# EAGLE board rx08-vrs (EAGLE 6.6.0)
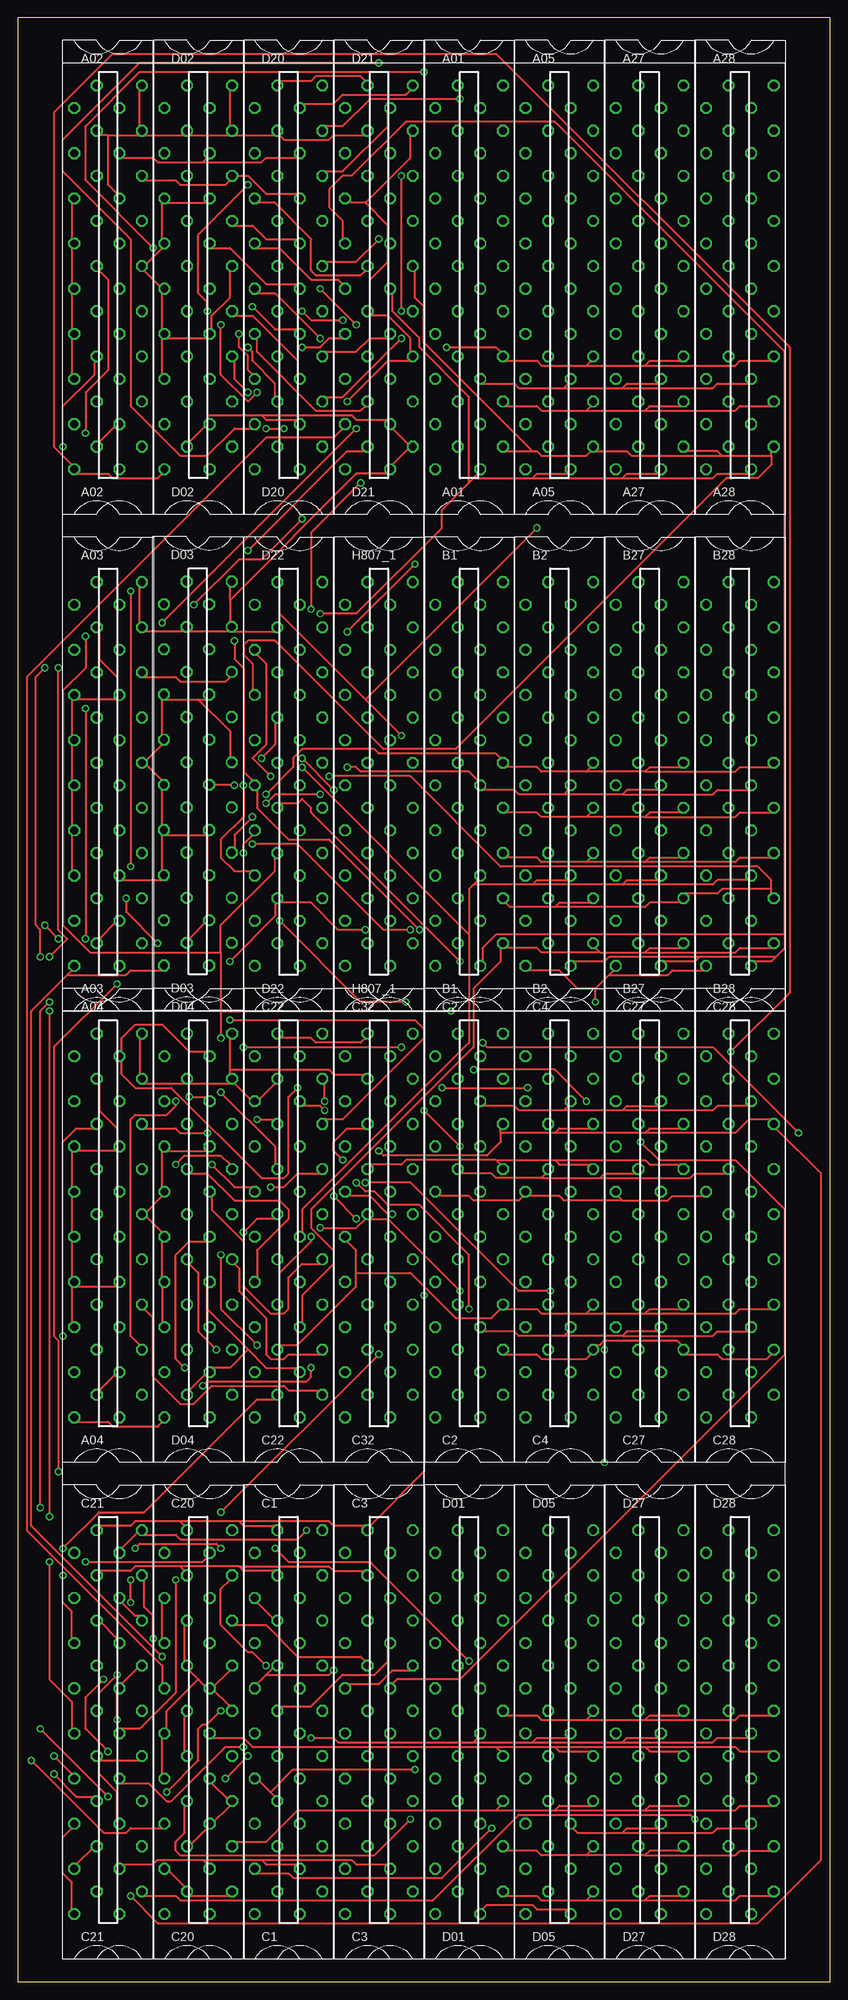
[diagram p1: board, top side]
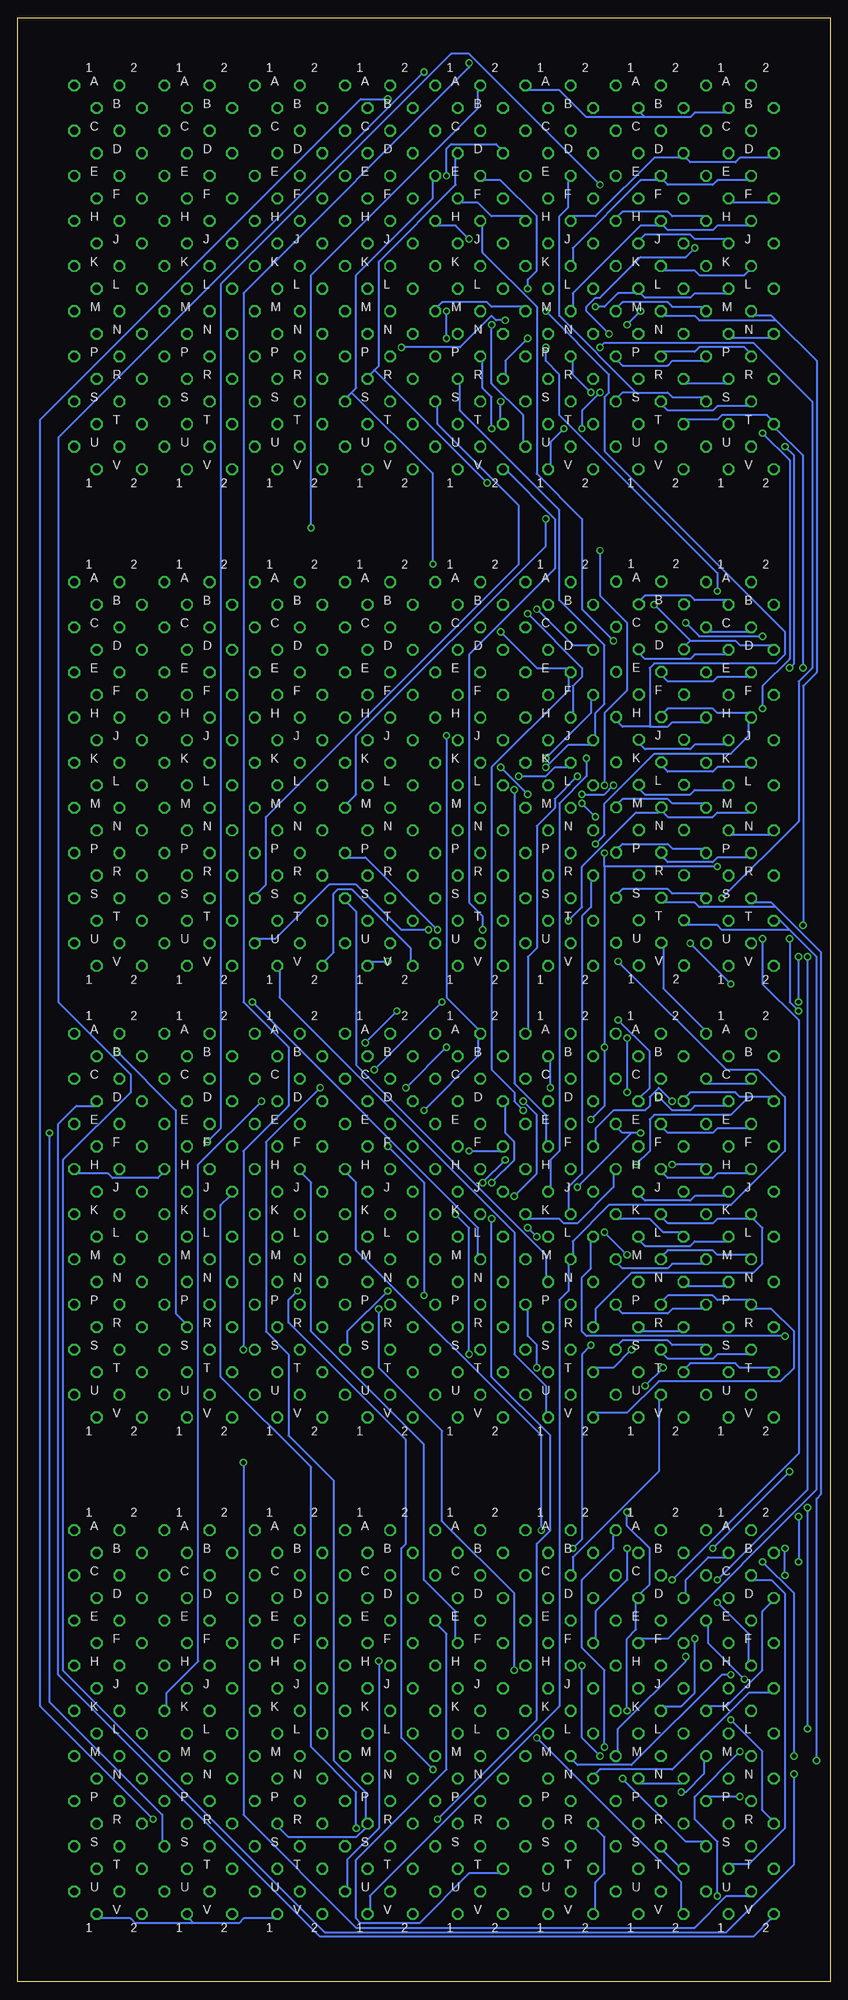
[diagram p2: board, bottom side, seen from below]

Size 114.3 x 276.23 mm. Coordinates in mm from the lower left corner, seen from the top.
Outline: 0,0 114.3,0 114.3,276.23 0,276.23 0,0
Copper layers (1*16): Top 0.035mm / dielectric 1.5mm / Bottom 0.035mm
Design rules "olimex10mil": minimum track width 10mil, minimum drill 24mil, track to track 10mil, track to pad 10mil, pad to pad 10mil, via to via 10mil, smd to smd 10mil, copper to edge 40mil, drill to drill 10mil, minimum pad ring 10mil, minimum via ring 8mil, stop-mask expansion 0mil, vias tented up to drill 0mil, thermal gap 10mil
Net classes: 1 Supply: width 1.905 mm, clearance 0.508 mm

## Footprints (pad centres in the part's own frame; a part is rotated, then mirrored left to right if it is on the bottom)
H807 = drill 1.092 octagon: A1 4.763,28.575; A2 -1.587,28.575; B1 1.587,25.4; B2 -4.763,25.4; C1 4.763,22.225; C2 -1.587,22.225; D1 1.587,19.05; D2 -4.763,19.05; E1 4.763,15.875; E2 -1.587,15.875; F1 1.587,12.7; F2 -4.763,12.7; H1 4.763,9.525; H2 -1.587,9.525; J1 1.587,6.35; J2 -4.763,6.35; K1 4.763,3.175; K2 -1.587,3.175; L1 1.587,0; L2 -4.763,0; M1 4.763,-3.175; M2 -1.587,-3.175; N1 1.587,-6.35; N2 -4.763,-6.35; P1 4.763,-9.525; P2 -1.587,-9.525; R1 1.587,-12.7; R2 -4.763,-12.7; S1 4.763,-15.875; S2 -1.587,-15.875; T1 1.587,-19.05; T2 -4.763,-19.05; U1 4.763,-22.225; U2 -1.587,-22.225; V1 1.587,-25.4; V2 -4.763,-25.4

## Placement (x,y rotation side)
A01  [H807]  63.5,238.12 0 top
A02  M903  [H807]  12.7,238.12 0 top
A03  M903  [H807]  12.7,168.28 0 top
A04  M903  [H807]  12.7,104.78 0 top
A05  [H807]  76.2,238.12 0 top
A27  [H807]  88.9,238.12 0 top
A28  [H807]  101.6,238.12 0 top
B1  [H807]  63.5,168.28 0 top
B2  [H807]  76.2,168.28 0 top
B27  [H807]  88.9,168.28 0 top
B28  [H807]  101.6,168.28 0 top
C1  [H807]  38.1,34.92 0 top
C2  [H807]  63.5,104.78 0 top
C3  M310  [H807]  50.8,34.92 0 top
C4  [H807]  76.2,104.78 0 top
C20  [H807]  25.4,34.92 0 top
C21  [H807]  12.7,34.92 0 top
C22  M624  [H807]  38.1,104.78 0 top
C27  [H807]  88.9,104.78 0 top
C28  [H807]  101.6,104.78 0 top
C32  M002  [H807]  50.8,104.78 0 top
D01  [H807]  63.5,34.92 0 top
D02  M903  [H807]  25.4,238.12 0 top
D03  M903  [H807]  25.34,168.34 0 top
D04  M903  [H807]  25.4,104.78 0 top
D05  [H807]  76.2,34.92 0 top
D20  [H807]  38.1,238.12 0 top
D21  [H807]  50.8,238.12 0 top
D22  M002  [H807]  38.1,168.28 0 top
D27  [H807]  88.9,34.92 0 top
D28  [H807]  101.6,34.92 0 top
H807_1  H807  [H807]  50.8,168.28 0 top
U$1  [CBLOCK]  6.35,136.53 0 top
U$2  [CBLOCK]  57.15,136.53 0 top
U$3  [CBLOCK]  6.35,3.17 0 top
U$4  [CBLOCK]  57.15,3.17 0 top

## Tracks (layer width: path | path; a pad name or v marks a point on that pad's centre or on a via)
AC00L  (via drill 0.61)
  Top 0.254: D04.B1 26.67,130.81 24.13,130.81 20.32,134.62 16.51,134.62 14.61,132.72 14.61,130.81 A04.B1 14.61,129.54 14.61,127.64 16.51,125.73 21.59,125.73 34.29,113.03 37.47,113.03 38.1,113.67 38.1,124.46 v39.37,125.73
  Bottom 0.254: v39.37,125.73 39.37,129.54 C22.B1
AC01L  (via drill 0.61)
  Top 0.254: v24.13,124.46 26.67,124.46 D04.D1 | v29.84,135.25 55.88,135.25 57.15,133.99 57.15,132.72 45.72,121.28 43.18,121.28 C22.E1
  Bottom 0.254: v24.13,124.46 22.23,122.56 19.68,122.56 19.05,123.19 14.61,123.19 A04.D1 | v29.84,135.25 25.4,130.81 25.4,125.73 26.67,124.46 D04.D1
AC02L  (via drill 0.61)
  Top 0.254: v26.67,119.38 22.86,119.38 22.23,120.02 17.78,120.02 A04.E1 | v35.56,111.76 37.47,111.76 39.37,113.67 42.55,113.67 C22.H1
  Bottom 0.254: 27.94,119.38 29.21,119.38 29.84,120.02 D04.E1 | v26.67,119.38 27.94,119.38 | 27.94,119.38 v35.56,111.76
AC03L  (via drill 0.61)
  Top 0.254: v22.23,114.94 23.5,116.2 28.57,116.2 29.84,114.94 D04.H1
  Bottom 0.254: v22.23,114.94 17.78,114.94 A04.H1 | C22.K1 42.55,107.31 38.1,107.31 37.47,106.68 35.56,106.68 30.48,111.76 30.48,113.67 D04.H1
AC04L
  Top 0.254: C22.M1 42.55,100.97 40.01,100.97 38.1,99.06 38.1,94.61 37.47,93.98 35.56,93.98 31.75,97.79 31.75,104.14 27.3,108.58 27.3,110.49 D04.J1
  Bottom 0.254: A04.J1 14.61,110.49 19.05,110.49 19.68,109.86 26.04,109.86 26.67,110.49 D04.J1
AC05L  (via drill 0.61)
  Top 0.254: v41.27,86.36 41.27,85.09 40.64,84.45 26.67,84.45 v26.04,83.82 | v23.5,86.36 22.23,87.63 22.23,102.23 24.13,104.14 26.67,104.14 D04.L1
  Bottom 0.254: A04.L1 14.61,104.14 19.05,104.14 19.68,103.5 26.04,103.5 26.67,104.14 D04.L1 | v41.27,86.36 41.27,89.53 42.55,90.81 42.55,94.61 C22.P1 | v23.5,86.36 v26.04,83.82
AC06L
  Top 0.254: C22.S1 42.55,88.27 38.1,88.27 37.47,87.63 35.56,87.63 34.92,88.27 34.92,93.34 31.11,97.16 31.11,100.33 30.48,100.97 D04.M1
  Bottom 0.254: A04.M1 17.78,100.97 22.23,100.97 22.86,100.33 29.21,100.33 29.84,100.97 D04.M1
AC07L
  Top 0.254: C22.U1 42.55,83.19 38.1,83.19 37.47,83.82 27.3,83.82 24.77,81.28 22.86,81.28 19.05,85.09 19.05,93.34 17.78,94.61 A04.P1
  Bottom 0.254: A04.P1 17.78,94.61 22.23,94.61 22.86,93.98 29.21,93.98 29.84,94.61 D04.P1
AC08L  (via drill 0.61)
  Top 0.254: v22.23,123.83 22.23,123.19 20.95,121.92 16.51,121.92 15.88,121.28 15.88,90.81 17.14,89.53 A04.S1
  Bottom 0.254: A04.S1 17.78,89.53 22.23,89.53 22.86,90.17 29.21,90.17 29.84,89.53 D04.S1 | v22.23,123.83 24.13,125.73 25.4,124.46 25.4,123.19 26.04,122.56 30.48,122.56 33.02,120.02 33.02,118.11 C22.F2
AC09L  (via drill 0.61)
  Top 0.254: v27.3,114.94 30.48,111.76 33.02,111.76 C22.J2
  Bottom 0.254: 11.43,124.46 12.7,124.46 13.34,125.09 19.68,125.09 20.32,124.46 D04.D2 | 11.43,124.46 8.26,124.46 A04.D2 | v27.3,114.94 25.4,116.84 25.4,121.28 24.77,121.92 13.97,121.92 11.43,124.46
AC10L  (via drill 0.61)
  Top 0.254: v6.35,90.81 6.35,118.11 8.26,120.02 10.79,120.02 A04.E2
  Bottom 0.254: A04.E2 11.43,120.02 15.88,120.02 16.51,119.38 22.86,119.38 23.5,120.02 D04.E2 | v6.35,90.81 34.29,90.81 34.92,91.44 34.92,99.06 33.66,100.33 33.66,104.14 C22.L2
AC11L
  Top 0.254: C22.N2 33.66,99.06 33.66,102.87 38.1,107.31 38.1,108.58 36.83,109.86 30.48,109.86 26.67,113.67 24.13,113.67 D04.H2
  Bottom 0.254: A04.H2 11.43,113.67 15.88,113.67 16.51,113.03 22.86,113.03 23.5,113.67 D04.H2
BAC00
  Bottom 0.254: 26.04,262.25 19.68,262.25 19.05,262.89 14.61,262.89 A02.B1 | 26.04,262.25 26.67,262.89 D02.B1 | 26.04,262.25 34.29,262.25 38.1,266.06 42.55,266.06 D20.A1
BAC01
  Top 0.254: 26.04,255.91 19.68,255.91 19.05,256.54 14.61,256.54 A02.D1 | 26.04,255.91 26.67,256.54 D02.D1 | 26.04,255.91 34.29,255.91 34.92,256.54 39.37,256.54 D20.D1
BAC02
  Top 0.254: A02.E1 17.78,253.37 22.23,253.37 22.86,252.73 29.21,252.73 29.84,253.37 D02.E1 32.38,254 34.92,251.46 39.37,251.46 D20.F1
BAC03
  Top 0.254: D20.J1 39.37,245.11 34.92,245.11 33.02,247.01 30.48,247.01 D02.H1
  Bottom 0.254: A02.H1 17.78,248.28 22.23,248.28 22.86,248.92 29.21,248.92 29.84,248.28 D02.H1
BAC04
  Top 0.254: D20.L1 39.37,238.76 34.92,238.76 29.84,243.84 27.3,243.84 D02.J1
  Bottom 0.254: A02.J1 14.61,245.11 19.05,245.11 19.68,245.75 26.04,245.75 26.67,245.11 D02.J1
BAC05  (via drill 0.61)
  Top 0.254: v33.02,235.59 36.2,232.41 39.37,232.41 D20.N1
  Bottom 0.254: A02.L1 14.61,237.49 19.05,237.49 19.68,236.85 26.04,236.85 26.67,237.49 D02.L1 27.3,237.49 29.84,237.49 31.75,235.59 v33.02,235.59
BAC06
  Top 0.254: D20.R1 39.37,226.06 39.37,227.97 33.02,234.31 30.48,234.31 D02.M1
  Bottom 0.254: A02.M1 17.78,235.59 22.23,235.59 22.86,236.22 29.21,236.22 29.84,235.59 D02.M1
BAC07  (via drill 0.61)
  Top 0.254: v34.92,218.44 v37.47,218.44 | v32.38,223.52 30.48,225.43 30.48,227.97 D02.P1
  Bottom 0.254: A02.P1 17.78,227.97 22.23,227.97 22.86,227.33 29.21,227.33 29.84,227.97 D02.P1 | v37.47,218.44 39.37,216.53 39.37,213.36 D20.V1 | v34.92,218.44 34.92,220.98 v32.38,223.52
BAC08
  Bottom 0.254: 27.3,223.52 29.21,223.52 29.84,222.88 D02.S1 | 27.3,223.52 22.86,223.52 22.23,222.88 17.78,222.88 A02.S1 | 27.3,223.52 38.1,234.31 38.1,248.28 36.83,249.56 36.83,253.37 D20.E2
BAC09
  Bottom 0.254: A02.D2 8.26,256.54 12.7,256.54 13.34,255.91 19.68,255.91 20.32,256.54 D02.D2 20.95,256.54 24.77,256.54 33.02,248.28 36.2,248.28 D20.H2
BAC10
  Bottom 0.254: A02.E2 11.43,253.37 15.88,253.37 16.51,252.73 22.86,252.73 23.5,253.37 D02.E2 24.13,253.37 26.67,253.37 36.2,243.84 36.2,241.94 D20.K2
BAC11
  Bottom 0.254: A02.H2 11.43,247.01 15.88,247.01 16.51,246.38 22.86,246.38 23.5,247.01 D02.H2 24.13,247.01 26.67,247.01 36.2,237.49 36.2,235.59 D20.M2
BACLR
  Bottom 0.254: D04.P2 23.5,95.89 22.86,96.52 16.51,96.52 15.88,95.89 11.43,95.89 A04.P2 10.79,94.61 8.26,94.61 5.08,91.44 5.08,86.36 6.99,84.45 24.13,84.45 28.57,80.01 33.02,80.01 C22.V2
BINIT  (via drill 0.61)
  Top 0.254: D02.V2 20.32,212.09 19.68,211.46 13.34,211.46 12.7,212.09 8.26,212.09 A02.V2 7.62,213.36 5.08,215.9 5.08,262.89 13.34,271.14 67.31,271.14 108.58,229.87 108.58,139.06 v100.33,130.81 | 76.83,90.81 70.48,90.81 69.85,91.44 65.41,91.44 C2.R1 | 76.83,90.81 77.47,91.44 C4.R1 | 85.09,90.81 85.72,91.44 90.17,91.44 C27.R1 | 85.09,90.81 76.83,90.81 | 85.09,90.81 97.79,90.81 98.42,91.44 102.87,91.44 C28.R1
  Bottom 0.254: v100.33,130.81 92.08,122.56 92.08,93.98 90.81,92.71 C27.R1
BIOP1  (via drill 0.61)
  Top 0.254: v22.23,56.52 22.23,40.64 17.14,35.56 14.61,35.56 C21.L1 | v9.53,179.07 v9.53,146.69 | v9.53,217.81 9.53,223.52 12.7,226.69 12.7,239.4 11.43,240.66 A02.K2
  Bottom 0.254: v22.23,56.52 4.45,74.3 4.45,135.25 9.53,140.34 v9.53,146.69 | v9.53,179.07 9.53,182.25 5.71,186.06 5.71,214 v9.53,217.81 | D02.K2 23.5,240.66 19.05,240.66 18.41,240.03 12.06,240.03 11.43,240.66 A02.K2
BIOP2  (via drill 0.61)
  Top 0.254: v4.45,59.05 4.45,42.55 7.62,39.37 7.62,35.56 C21.L2 | v4.45,136.53 v4.45,65.41 | v3.81,148.59 v5.71,146.69
  Bottom 0.254: v4.45,65.41 v4.45,59.05 | v4.45,136.53 5.71,137.79 v5.71,146.69 | v3.81,148.59 3.81,182.25 1.91,184.15 1.91,227.97 7.62,233.68 | 7.62,233.68 8.26,234.31 10.79,234.31 A02.M2 | 7.62,233.68 18.41,233.68 19.05,234.31 23.5,234.31 D02.M2
BIOP4  (via drill 0.61)
  Top 0.254: v3.17,35.56 v12.7,26.04 | v3.17,66.67 3.17,136.53 v4.45,137.79 | v4.45,144.15 6.99,146.69 5.71,147.96 v5.71,184.78 | v6.35,215.9 6.35,221.62 10.79,226.06 10.79,227.97 A02.P2
  Bottom 0.254: v12.7,26.04 17.14,26.04 C21.P1 | v3.17,35.56 v3.17,66.67 | v4.45,137.79 v4.45,144.15 | v5.71,184.78 5.08,185.42 5.08,214.63 v6.35,215.9 | D02.P2 23.5,229.24 19.05,229.24 18.41,229.87 12.06,229.87 11.43,229.24 A02.P2
BIRQ  (via drill 0.61)
  Top 0.254: v27.94,88.9 25.4,91.44 25.4,99.69 24.13,100.97 D04.M2
  Bottom 0.254: A04.M2 11.43,102.23 15.88,102.23 16.51,102.87 22.86,102.87 23.5,102.23 D04.M2 | v27.94,88.9 30.48,86.36 33.02,86.36 C22.T2
BMB00
  Bottom 0.254: A03.B1 14.61,194.31 19.05,194.31 19.68,194.94 26.04,194.94 26.67,194.31 D03.B1
BMB01
  Bottom 0.254: A03.D1 14.61,186.69 19.05,186.69 19.68,186.06 26.04,186.06 26.67,186.69 D03.D1
BMB02
  Top 0.254: A03.E1 17.78,183.51 22.23,183.51 22.86,182.88 29.21,182.88 29.84,183.51 D03.E1
BMB03
  Bottom 0.254: A03.J1 14.61,173.99 19.05,173.99 19.68,173.35 26.04,173.35 26.67,173.99 D03.J1
BMB03L  (via drill 0.61)
  Top 0.254: 80.01,227.33 73.66,227.33 73.03,227.97 68.58,227.97 A01.P1 67.94,229.24 67.31,229.87 v60.33,229.87 | 80.01,227.33 80.64,227.97 A05.P1 | 88.27,227.33 88.9,227.97 93.34,227.97 A27.P1 | 80.01,227.33 88.27,227.33 | 88.27,227.33 100.97,227.33 101.6,227.97 106.05,227.97 A28.P1 | v40.01,234.95 41.27,233.68 v45.72,233.68
  Bottom 0.254: 25.4,176.53 29.21,176.53 29.84,177.16 D03.H1 | 25.4,176.53 22.86,176.53 22.23,177.16 17.78,177.16 A03.H1 | 25.4,176.53 25.4,184.78 24.77,185.42 7.62,185.42 6.35,186.69 6.35,189.87 31.75,215.26 31.75,222.88 31.11,223.52 31.11,226.06 v40.01,234.95 | v45.72,233.68 46.99,233.68 47.62,234.31 52.07,229.87 v60.33,229.87
BMB04
  Bottom 0.254: A03.M1 17.78,165.74 22.23,165.74 22.86,166.37 29.21,166.37 29.84,165.74 D03.M1
BMB04L  (via drill 0.61)
  Top 0.254: 80.01,170.18 73.66,170.18 73.03,170.81 68.58,170.81 B1.K1 67.94,172.09 67.31,172.72 50.8,172.72 50.16,173.35 40.01,173.35 38.73,172.09 38.73,170.81 v34.92,167 | 80.01,170.18 80.64,170.81 B2.K1 | 88.27,170.18 88.9,170.81 93.34,170.81 B27.K1 | 88.27,170.18 80.01,170.18 | 88.27,170.18 100.97,170.18 101.6,170.81 106.05,170.81 B28.K1 | v30.48,168.28 27.3,168.28 D03.L1
  Bottom 0.254: A03.L1 14.61,167.64 19.05,167.64 19.68,167 26.04,167 26.67,167.64 D03.L1 | v30.48,168.28 31.75,167 v34.92,167
BMB05
  Bottom 0.254: A03.S1 17.78,153.03 22.23,153.03 22.86,153.67 29.21,153.67 29.84,153.03 D03.S1
BMB05L  (via drill 0.61)
  Top 0.254: 76.83,167 70.48,167 69.85,167.64 65.41,167.64 B1.L1 64.77,168.91 63.5,170.18 48.26,170.18 47.62,170.81 v46.35,170.81 | 76.83,167 77.47,167.64 B2.L1 | 85.09,167 85.72,167.64 90.17,167.64 B27.L1 | 85.09,167 76.83,167 | 85.09,167 97.79,167 98.42,167.64 102.87,167.64 B28.L1 | v33.02,163.83 30.48,161.29 30.48,159.38 D03.P1 | v34.92,165.74 36.2,167 v42.55,167
  Bottom 0.254: A03.P1 17.78,159.38 22.23,159.38 22.86,160.02 29.21,160.02 29.84,159.38 D03.P1 | v34.92,165.74 v33.02,163.83 | v46.35,170.81 v42.55,167
BMB06
  Bottom 0.254: A03.E2 11.43,183.51 15.88,183.51 16.51,182.88 22.86,182.88 23.5,183.51 D03.E2
BMB06L  (via drill 0.61)
  Top 0.254: 80.01,163.83 73.66,163.83 73.03,164.47 68.58,164.47 B1.M1 | 80.01,163.83 80.64,164.47 B2.M1 | 88.27,163.83 88.9,164.47 93.34,164.47 B27.M1 | 88.27,163.83 80.01,163.83 | 88.27,163.83 100.97,163.83 101.6,164.47 106.05,164.47 B28.M1 | v24.77,193.68 31.11,200.03 34.29,200.03 v40.01,205.74
  Bottom 0.254: 19.68,188.59 13.34,188.59 12.7,187.96 8.26,187.96 A03.D2 | 19.68,188.59 20.32,187.96 D03.D2 | v24.77,193.68 19.68,188.59 | v40.01,205.74 40.01,201.93 66.67,175.26 66.67,167 67.94,165.74 B1.M1
BMB07
  Bottom 0.254: A03.K2 11.43,170.81 15.88,170.81 16.51,170.18 22.86,170.18 23.5,170.81 D03.K2
BMB07L  (via drill 0.61)
  Top 0.254: 80.01,157.48 73.66,157.48 73.03,158.12 68.58,158.12 B1.P1 | 80.01,157.48 80.64,158.12 B2.P1 | 88.27,157.48 88.9,158.12 93.34,158.12 B27.P1 | 88.27,157.48 80.01,157.48 | 88.27,157.48 100.97,157.48 101.6,158.12 106.05,158.12 B28.P1 | v33.02,160.02 39.37,160.02 51.44,147.96 v55.24,147.96
  Bottom 0.254: D03.H2 23.5,178.44 22.86,179.07 16.51,179.07 15.88,178.44 11.43,178.44 A03.H2 11.43,177.16 11.43,175.26 13.97,172.72 24.77,172.72 31.75,165.74 31.75,161.29 v33.02,160.02 | v55.24,147.96 65.41,158.12 67.94,158.12 B1.P1
BMB08
  Bottom 0.254: A03.P2 11.43,158.12 15.88,158.12 16.51,157.48 22.86,157.48 23.5,158.12 D03.P2
BMB08L  (via drill 0.61)
  Top 0.254: 80.01,36.83 73.66,36.83 73.03,37.47 68.58,37.47 D01.K1 | 80.01,36.83 80.64,37.47 D05.K1 | 88.27,36.83 88.9,37.47 93.34,37.47 D27.K1 | 80.01,36.83 88.27,36.83 | 88.27,36.83 100.97,36.83 101.6,37.47 106.05,37.47 D28.K1 | v36.83,149.22 48.26,137.79 v54.61,137.79 | v64.14,128.27 75.56,128.27 v80.01,123.83
  Bottom 0.254: A03.M2 11.43,164.47 15.88,164.47 16.51,163.83 22.86,163.83 23.5,164.47 D03.M2 24.13,164.47 27.3,164.47 34.92,156.84 34.92,151.13 v36.83,149.22 | v64.14,128.27 v54.61,137.79 | v80.01,123.83 88.9,114.94 88.9,45.09 93.34,40.64 93.34,38.73 D27.K1
BMB09  (via drill 0.61)
  Top 0.254: v1.91,31.11 12.06,20.95 15.24,20.95 15.88,21.59 20.32,21.59 C20.R2
  Bottom 0.254: v1.91,31.11 1.91,67.94 1.27,68.58 1.27,144.78 7.62,151.13 | 7.62,151.13 8.26,151.76 10.79,151.76 A03.S2 | 7.62,151.13 18.41,151.13 19.05,151.76 23.5,151.76 D03.S2
BMB10
  Bottom 0.254: 5.71,147.96 7.62,149.86 A03.T2 | 5.71,147.96 1.91,144.15 1.91,69.22 22.86,48.26 26.67,48.26 C20.F1 | 5.71,147.96 15.24,147.96 15.88,148.59 20.32,148.59 D03.T2
BMB11  (via drill 0.61)
  Top 0.254: v20.32,45.72 1.91,64.14 1.91,136.53 6.99,141.6 | 6.99,141.6 7.62,142.24 A03.V2 | 6.99,141.6 15.24,141.6 15.88,142.24 20.32,142.24 D03.V2
  Bottom 0.254: v20.32,45.72 20.32,45.09 29.84,35.56 29.84,32.38 C20.M1
BRD_L  (via drill 0.61)
  Top 0.254: v55.24,22.86 50.16,17.78 22.86,17.78 22.23,18.41 22.23,19.68 23.5,20.95 23.5,24.77 C20.P2 | v47.62,107.31 v44.45,110.49 | v43.18,123.83 43.18,126.36 C22.C1
  Bottom 0.254: v55.24,22.86 41.27,36.83 41.27,61.59 39.37,63.5 39.37,76.83 47.62,85.09 v47.62,107.31 | v44.45,110.49 41.27,113.67 41.27,121.92 v43.18,123.83
BRUN
  Bottom 0.254: A04.S2 11.43,88.27 15.88,88.27 16.51,87.63 22.86,87.63 23.5,88.27 D04.S2
BSKIP
  Bottom 0.254: D04.K2 23.5,107.31 22.86,106.68 16.51,106.68 15.88,107.31 11.43,107.31 A04.K2 10.79,107.31 9.53,106.05 9.53,100.97 10.79,99.69 27.94,99.69 33.02,94.61 33.02,92.71 C22.R2
BTS1  (via drill 0.61)
  Top 0.254: v15.88,53.34 v15.88,56.52 | v3.17,144.15 3.17,147.96 2.54,148.59 2.54,183.51 v3.81,184.78
  Bottom 0.254: v15.88,53.34 11.43,48.9 11.43,45.09 C21.H2 | v15.88,56.52 3.17,69.22 v3.17,144.15 | v3.81,184.78 3.81,214.63 7.62,218.44 A02.T2 8.26,219.71 8.89,220.34 15.24,220.34 15.88,219.71 20.32,219.71 D02.T2
BTS3
  Bottom 0.254: A02.S2 11.43,221.62 15.88,221.62 16.51,220.98 22.86,220.98 23.5,221.62 D02.S2
BWR_L  (via drill 0.61)
  Top 0.254: 48.9,250.19 46.35,250.19 D21.F2 | 48.9,250.19 52.07,247.01 52.07,245.11 D21.J1 52.07,243.84 52.07,241.94 49.53,239.4 49.53,235.59 D21.M2 49.53,234.31 52.07,234.31 55.24,231.14 55.24,229.24 D21.P1 55.24,227.97 52.07,227.97 v46.35,222.25 | 48.9,250.19 55.24,256.54 55.24,259.71 D21.C1 | C20.J2 20.32,41.91 20.32,44.45 1.27,63.5 1.27,183.51 34.92,217.17 44.45,217.17 45.72,218.44 D21.T2
  Bottom 0.254: v46.35,222.25 46.35,219.71 D21.T2
C0L  (via drill 0.61)
  Top 0.254: C21.E1 17.14,51.44 16.51,51.44 14.61,53.34 C21.D1 | v50.8,116.84 51.44,116.2 66.04,116.2 67.94,118.11 67.94,119.38 | 67.94,119.38 67.94,120.02 C2.E1 | 75.56,119.38 76.2,120.02 80.64,120.02 C4.E1 | 75.56,119.38 67.94,119.38 | 88.27,119.38 88.9,120.02 93.34,120.02 C27.E1 | 88.27,119.38 75.56,119.38 | 88.27,119.38 100.97,119.38 102.87,121.28 106.05,121.28 C28.E1 106.68,120.02 113.03,113.67 113.03,17.14 104.14,8.26 19.68,8.26 v15.88,12.06 | v12.06,42.55 9.53,40.01 9.53,35.56 v12.7,32.38
  Bottom 0.254: v50.8,116.84 46.35,116.84 C32.F2 | v12.06,42.55 17.14,47.62 17.14,50.16 C21.E1 | v12.7,32.38 19.05,26.04 19.05,22.86 15.88,19.68 v15.88,12.06
C1L  (via drill 0.61)
  Top 0.254: C20.F2 20.32,48.26 20.32,53.34 C20.D2 | C21.B1 14.61,60.96 17.14,63.5 C21.A1 17.78,62.87 22.23,62.87 22.86,62.23 39.37,62.23 v40.64,63.5 | 67.31,115.57 54.61,115.57 53.98,114.94 49.53,114.94 C32.H2 | 67.31,115.57 67.94,114.94 C2.H1 | 75.56,115.57 76.2,114.94 80.64,114.94 C4.H1 | 67.31,115.57 75.56,115.57 | 75.56,115.57 88.27,115.57 88.9,114.94 93.34,114.94 C27.H1
  Bottom 0.254: C20.D2 20.32,54.61 20.32,56.52 17.14,59.69 14.61,59.69 C21.B1 | C28.H1 106.05,113.67 101.6,113.67 100.97,113.03 94.61,113.03 93.98,113.67 C27.H1 | v40.64,63.5 40.64,76.83 66.67,102.87 66.67,112.39 67.94,113.67 C2.H1
C20U1
  Top 0.254: 27.3,41.27 29.84,38.73 C20.K1 | 25.4,42.55 26.67,41.27 C20.J1 27.3,41.27 | 25.4,42.55 24.13,43.81 C20.H2 23.5,45.09 23.5,50.16 C20.E2 | 27.3,41.27 29.84,43.81 C20.H1 | C20.N2 20.32,29.21 20.32,34.29 C20.L2 20.95,35.56 20.95,38.1 25.4,42.55 | C20.T2 20.95,15.88 23.5,13.34 C20.U2 24.13,12.06 29.84,12.06 C20.U1 | C20.S2 24.13,19.05 26.67,21.59 C20.R1 27.3,22.23 29.84,24.77 C20.P1 29.84,25.4 27.3,27.94 C20.N1
  Bottom 0.254: C20.S2 23.5,18.41 20.95,15.88 C20.T2 | C20.N2 20.95,27.94 26.67,27.94 C20.N1
C21U1  (via drill 0.61)
  Top 0.254: v95.25,22.86 94.61,23.5 70.48,23.5 58.42,11.43 22.86,11.43 22.23,12.06 17.78,12.06 C21.U1 | v62.23,264.8 49.53,264.8 45.72,260.99 43.18,260.99 D20.C1
  Bottom 0.254: v95.25,22.86 111.12,38.73 111.12,219.71 66.04,264.8 v62.23,264.8
DATA00LL  (via drill 0.61)
  Top 0.254: v35.56,169.54 33.02,172.09 34.92,173.99 34.92,185.42 33.66,186.69 D22.D2 | 76.83,224.16 70.48,224.16 69.85,224.79 65.41,224.79 A01.R1 | 76.83,224.16 77.47,224.79 A05.R1 | 85.09,224.16 85.72,224.79 90.17,224.79 A27.R1 | 76.83,224.16 85.09,224.16 | 85.09,224.16 97.79,224.16 98.42,224.79 102.87,224.79 A28.R1 | v41.27,193.04 41.27,203.84 v48.26,210.82
  Bottom 0.254: v35.56,169.54 38.73,166.37 38.73,165.1 41.27,162.56 41.27,145.41 42.55,144.15 42.55,133.99 C22.A1 | 64.14,226.69 64.77,226.06 A01.R1 | 64.14,226.69 63.5,227.33 63.5,241.94 52.7,252.73 52.7,256.54 D21.D1 | v41.27,193.04 36.2,187.96 33.66,187.96 D22.D2 | v48.26,210.82 64.14,226.69
DATA01L  (via drill 0.61)
  Top 0.254: v43.18,122.56 42.55,123.19 40.01,123.19 C22.D1 | 80.01,220.98 73.66,220.98 73.03,221.62 68.58,221.62 A01.S1 | 80.01,220.98 80.64,221.62 A05.S1 | 88.27,220.98 88.9,221.62 93.34,221.62 A27.S1 | 80.01,220.98 88.27,220.98 | 88.27,220.98 100.97,220.98 101.6,221.62 106.05,221.62 A28.S1 | v55.88,199.39 v46.35,189.87
  Bottom 0.254: v43.18,122.56 44.45,123.83 44.45,125.09 47.62,128.27 47.62,170.81 36.83,181.61 36.83,183.51 D22.E2 36.83,184.78 41.27,184.78 v46.35,189.87 | 67.31,223.52 67.94,222.88 A01.S1 | 67.31,223.52 66.67,224.16 66.67,240.03 55.88,250.82 55.88,253.37 D21.E1 | v55.88,199.39 55.88,212.09 67.31,223.52
DATA02L  (via drill 0.61)
  Top 0.254: 72.39,215.26 73.03,215.26 73.66,214.63 80.01,214.63 80.64,215.26 A05.U1 81.28,215.26 85.72,215.26 86.36,214.63 99.06,214.63 | 72.39,215.26 68.58,215.26 A01.U1 | 72.39,215.26 57.15,230.5 57.15,235.59 55.88,236.85 55.88,240.66 D21.K1 | 106.05,214.63 106.05,215.26 A28.U1 | 106.05,214.63 106.05,213.36 104.14,211.46 99.69,211.46 61.59,173.35 51.44,173.35 36.2,188.59 32.38,188.59 31.75,187.96 31.75,186.69 33.02,185.42 33.02,181.61 D22.F2 | v40.01,172.09 v44.45,167.64 | 99.06,214.63 98.42,215.26 93.98,215.26 A27.U1 | 99.06,214.63 106.05,214.63
  Bottom 0.254: v44.45,167.64 44.45,126.36 40.01,121.92 40.01,118.11 C22.F1 | v40.01,172.09 33.66,178.44 33.66,180.34 D22.F2
DATA03L  (via drill 0.61)
  Top 0.254: v42.55,192.41 47.62,192.41 59.69,204.47 59.69,207.01 63.5,210.82 | 64.14,211.46 64.77,212.09 A01.V1 | 63.5,210.82 64.14,211.46 | v34.29,172.09 36.2,173.99 36.2,177.16 D22.H2 | 63.5,210.82 63.5,222.88 56.52,229.87 56.52,231.14 52.7,234.95 52.7,237.49 D21.L1 | 72.39,211.46 73.03,212.09 77.47,212.09 A05.V1 | 64.14,211.46 72.39,211.46 | 85.09,211.46 85.72,212.09 90.17,212.09 A27.V1 | 72.39,211.46 85.09,211.46 | 85.09,211.46 97.79,211.46 98.42,212.09 102.87,212.09 A28.V1
  Bottom 0.254: v42.55,192.41 34.92,184.78 34.92,183.51 36.2,182.25 36.2,178.44 D22.H2 | v34.29,172.09 34.29,169.54 38.1,165.74 38.1,116.84 39.37,115.57 39.37,111.76 C22.J1
DATA04L  (via drill 0.61)
  Top 0.254: 63.5,147.32 63.5,153.67 64.14,154.31 | 63.5,147.32 63.5,132.08 40.01,108.58 40.01,105.41 C22.L1 | 64.14,154.31 64.77,154.94 B1.R1 | 72.39,154.31 73.03,154.94 77.47,154.94 B2.R1 | 72.39,154.31 64.14,154.31 | 85.09,154.31 85.72,154.94 90.17,154.94 B27.R1 | 85.09,154.31 72.39,154.31 | 85.09,154.31 97.79,154.31 98.42,154.94 102.87,154.94 B28.R1 | 63.5,147.32 v40.01,170.81
  Bottom 0.254: v40.01,170.81 36.83,173.99 33.66,173.99 D22.J2 33.02,175.26 33.02,178.44 31.75,179.71 31.75,187.96 38.1,194.31 38.1,207.01 52.07,220.98 52.07,224.79 D21.R1
DATA05L  (via drill 0.61)
  Top 0.254: v43.81,169.54 55.24,169.54 67.94,156.84 104.14,156.84 106.05,154.94 106.05,153.67 | 106.05,153.67 106.05,153.03 B28.S1 | 106.05,153.67 99.06,153.67 98.42,153.03 93.98,153.03 B27.S1 93.34,151.76 88.9,151.76 88.27,151.13 75.56,151.13 | 75.56,151.13 76.2,151.76 80.64,151.76 B2.S1 | 75.56,151.13 69.22,151.13 68.58,151.76 B1.S1
  Bottom 0.254: v43.81,169.54 40.01,169.54 38.73,170.81 36.83,170.81 D22.K2 | C22.N1 40.01,99.06 40.01,102.23 66.67,128.91 66.67,150.5 67.94,151.76 B1.S1 | D21.S1 55.24,221.62 55.24,219.07 43.81,207.65 43.81,199.39 79.38,163.83 79.38,154.31 80.64,153.03 B2.S1
DATA06L  (via drill 0.61)
  Top 0.254: C22.R1 40.01,92.71 40.01,96.52 44.45,100.97 44.45,102.87 41.27,106.05 41.27,108.58 64.14,131.44 64.14,139.7 67.94,143.51 67.94,145.41 B1.U1 68.58,145.41 73.03,145.41 73.66,144.78 81.92,144.78 | v56.52,147.96 43.81,160.66 38.1,160.66 33.66,165.1 33.66,167.64 D22.L2 33.02,168.91 31.75,170.18 31.75,184.78 30.48,186.06 v30.48,188.59 | 88.27,144.78 88.9,145.41 93.34,145.41 B27.U1 | 81.92,144.78 88.27,144.78 | 81.92,144.78 81.28,145.41 B2.U1 | 88.27,144.78 100.97,144.78 101.6,145.41 106.05,145.41 B28.U1
  Bottom 0.254: v56.52,147.96 60.33,147.96 66.67,154.31 70.48,154.31 78.11,146.69 80.64,146.69 B2.U1 | v30.48,188.59 34.92,193.04 34.92,205.74 41.27,212.09 41.27,235.59 48.9,243.21 48.9,247.01 D21.H2
DATA07L  (via drill 0.61)
  Top 0.254: v62.23,143.51 41.27,164.47 41.27,165.1 40.01,166.37 39.37,165.74 36.83,165.74 D22.M2 | 107.95,147.32 107.95,145.41 106.68,144.15 | 107.95,147.32 107.95,229.24 75.56,261.62 54.61,261.62 46.99,254 45.72,254 43.81,252.09 43.81,249.56 45.72,247.65 45.72,245.11 D21.J2 | 106.68,144.15 106.05,143.51 103.5,143.51 B28.V1 | 95.89,144.15 95.25,143.51 90.81,143.51 B27.V1 | 106.68,144.15 95.89,144.15 | 107.95,147.32 67.31,147.32 65.41,145.41 65.41,143.51 B1.V1 | 95.89,144.15 83.19,144.15 82.55,143.51 78.11,143.51 B2.V1
  Bottom 0.254: C22.V1 40.01,80.01 40.01,83.82 44.45,88.27 44.45,105.41 77.47,138.43 77.47,142.24 B2.V1 | v62.23,143.51 64.77,143.51 B1.V1
DATA08L  (via drill 0.61)
  Top 0.254: 85.09,20.95 85.72,21.59 90.17,21.59 D27.R1 | 85.09,20.95 78.74,20.95 78.11,21.59 D05.R1 | 85.09,20.95 97.79,20.95 98.42,21.59 102.87,21.59 D28.R1 | v33.66,121.28 36.2,121.28 C22.E2 | v31.75,158.75 31.75,160.02 33.02,161.29 D22.N2 | v40.01,229.87 42.55,229.87 43.81,231.14 45.72,231.14 D21.N2 | v15.88,195.58 v15.88,156.84 | v59.69,125.73 v71.75,125.73 | v31.75,131.44 v53.98,131.44
  Bottom 0.254: D05.R1 77.47,21.59 76.2,20.32 66.67,20.32 65.41,21.59 D01.R1 65.41,22.86 65.41,26.67 69.85,31.11 69.85,70.48 76.2,76.83 76.2,88.27 79.38,91.44 79.38,118.11 v71.75,125.73 | v33.66,121.28 31.75,123.19 v31.75,131.44 31.75,156.84 | 31.75,156.84 v31.75,158.75 | v40.01,229.87 40.01,227.97 38.1,226.06 38.1,220.34 15.88,198.12 v15.88,195.58 | v15.88,156.84 31.75,156.84 | v53.98,131.44 v59.69,125.73
DATA09L  (via drill 0.61)
  Top 0.254: 80.01,17.78 73.66,17.78 73.03,18.41 68.58,18.41 D01.S1 | 80.01,17.78 80.64,18.41 D05.S1 | 88.27,17.78 88.9,18.41 93.34,18.41 D27.S1 | 88.27,17.78 80.01,17.78 | 88.27,17.78 100.97,17.78 101.6,18.41 106.05,18.41 D28.S1 | v28.57,125.09 36.2,117.47 36.2,114.94 C22.H2 | 28.57,144.78 28.57,148.59 36.2,156.21 36.2,158.12 D22.P2 | 28.57,144.78 28.57,136.53 | 28.57,136.53 v28.57,132.72 | v47.62,218.44 v20.32,191.13 | v9.53,189.23 9.53,184.78 6.35,181.61 6.35,148.59 10.16,144.78 28.57,144.78 | v109.86,119.38 97.79,131.44 66.04,131.44 v65.41,132.08 | 28.57,136.53 v60.96,136.53
  Bottom 0.254: v28.57,132.72 v28.57,125.09 | v47.62,218.44 47.62,222.88 48.9,224.16 48.9,227.97 D21.P2 | v20.32,191.13 18.41,189.23 v9.53,189.23 | v109.86,119.38 109.86,39.37 93.98,23.5 93.98,19.68 D27.S1 | v60.96,136.53 v65.41,132.08
DATA10L  (via drill 0.61)
  Top 0.254: 80.01,11.43 73.66,11.43 73.03,12.06 68.58,12.06 D01.U1 | 80.01,11.43 80.64,12.06 D05.U1 | 88.27,11.43 88.9,12.06 93.34,12.06 D27.U1 | 80.01,11.43 88.27,11.43 | 88.27,11.43 100.97,11.43 101.6,12.06 106.05,12.06 D28.U1 | v32.38,201.29 46.35,215.26 48.9,215.26 D21.U2 | v31.75,168.28 31.75,163.83 28.57,160.66 28.57,158.12 30.48,156.21 33.02,156.21 D22.R2 | v63.5,45.09 49.53,59.05 38.1,59.05 v36.2,60.96 | v33.66,89.53 28.57,94.61 v28.57,102.23 | v31.75,105.41 33.66,107.31 36.2,107.31 C22.K2
  Bottom 0.254: D22.R2 33.66,154.94 33.66,151.13 34.92,149.86 34.92,113.67 36.83,111.76 36.83,108.58 C22.K2 | v32.38,201.29 32.38,194.94 28.57,191.13 28.57,181.61 31.75,178.44 v31.75,168.28 | v63.5,45.09 63.5,21.59 67.94,17.14 67.94,13.34 D01.U1 | v36.2,60.96 34.92,62.23 34.92,88.27 v33.66,89.53 | v31.75,105.41 v28.57,102.23
DATA11L  (via drill 0.61)
  Top 0.254: v48.9,147.96 45.09,147.96 41.27,151.76 36.83,151.76 D22.S2 36.2,151.76 36.2,149.86 v29.84,143.51 | D05.V1 77.47,10.16 73.03,10.16 72.39,10.79 66.04,10.79 65.41,10.16 D01.V1
  Bottom 0.254: v48.9,147.96 48.9,149.86 50.8,151.76 50.8,186.69 38.73,198.75 38.73,205.74 45.72,212.72 D21.V2 | 89.53,8.26 83.19,8.26 82.55,8.89 78.11,8.89 D05.V1 | 89.53,8.26 90.17,8.89 D27.V1 | 89.53,8.26 97.79,8.26 98.42,8.89 102.87,8.89 D28.V1 | D01.V1 64.77,10.16 64.77,12.06 38.1,38.73 38.1,95.89 36.83,97.16 36.83,100.97 C22.M2 36.2,102.23 36.2,104.14 31.11,109.22 13.97,109.22 6.35,116.84 6.35,124.46 10.16,128.27 14.61,128.27 v29.84,143.51
GND
  Top 0.254: 55.24,215.9 52.7,213.36 D21.V1 52.07,212.09 47.62,212.09 29.84,194.31 | 55.24,215.9 52.7,218.44 D21.T1 52.07,219.71 47.62,219.71 46.99,220.34 34.29,220.34 | 55.24,215.9 D21.U1 | D02.U2 24.13,216.53 26.67,219.07 D02.T1 26.67,219.71 26.67,220.34 | 26.67,220.34 26.67,224.79 D02.R1 26.67,226.06 26.67,231.14 | D02.K1 29.84,240.66 29.84,236.85 27.3,234.31 27.3,232.41 D02.N1 26.67,231.14 | 34.29,220.34 34.92,219.71 39.37,219.71 D20.T1 | 26.67,220.34 34.29,220.34 | 12.7,259.71 17.14,259.71 A02.C1 | 12.7,259.71 11.43,259.71 A02.C2 | A02.C1 17.78,259.71 23.5,259.71 D02.C2 24.13,259.71 29.84,259.71 D02.C1 | A02.A1 17.14,266.06 17.14,260.99 A02.C1 | D02.C1 29.84,260.99 29.84,266.06 D02.A1 | D02.C1 30.48,259.71 36.2,259.71 D20.C2 36.83,259.71 37.47,259.08 43.81,259.08 44.45,259.71 48.9,259.71 D21.C2 | D02.R2 20.32,226.06 20.32,231.14 D02.N2 | D02.F1 26.67,250.19 20.95,250.19 D02.F2 20.32,250.19 20.32,245.11 D02.J2 20.32,243.84 17.78,241.3 A02.K1 17.78,240.66 20.32,238.12 D02.L2 20.32,237.49 20.32,232.41 D02.N2 | A02.U2 11.43,216.53 13.97,219.07 A02.T1 13.97,219.71 13.97,224.79 A02.R1 13.97,226.06 13.97,231.14 A02.N1 | A02.R2 7.62,226.06 7.62,231.14 A02.N2 7.62,232.41 7.62,237.49 A02.L2 7.62,238.76 7.62,243.84 A02.J2 7.62,245.11 7.62,250.19 A02.F2 | 12.7,259.71 12.7,252.73 13.97,251.46 A02.F1 | 26.67,231.14 20.95,231.14 D02.N2 | D03.U2 24.13,146.69 26.67,149.22 D03.T1 26.67,149.86 26.67,154.94 D03.R1 26.67,156.21 26.67,161.29 | D03.N2 20.32,161.29 20.32,156.21 D03.R2 20.32,154.94 14.61,154.94 A03.R1 | 17.78,171.45 20.32,168.91 D03.L2 20.32,167.64 20.32,162.56 D03.N2
  Top 0.254: 17.78,171.45 20.32,173.99 D03.J2 20.32,175.26 20.32,180.34 D03.F2 20.95,180.34 25.4,180.34 | 17.78,171.45 A03.K1 | 25.4,180.34 26.67,180.34 D03.F1 | 25.4,180.34 29.84,175.9 29.84,172.09 D03.K1 | 26.67,161.29 20.95,161.29 D03.N2 | 26.67,161.29 D03.N1 | 29.84,194.31 29.84,196.22 D03.A1 | 29.84,194.31 29.84,191.13 D03.C1 | D22.C2 36.2,189.87 30.48,189.87 D03.C1 | A03.A1 17.14,196.22 17.14,191.13 A03.C1 17.78,189.87 23.5,189.87 D03.C2 24.13,189.87 29.84,189.87 D03.C1 | A03.U2 11.43,146.69 13.97,149.22 A03.T1 13.97,149.86 13.97,154.94 A03.R1 | A03.N1 13.97,161.29 13.97,156.21 A03.R1 | A03.R2 7.62,156.21 7.62,161.29 A03.N2 7.62,162.56 7.62,167.64 A03.L2 7.62,168.91 7.62,173.99 A03.J2 7.62,175.26 7.62,180.34 A03.F2 8.26,180.34 13.97,180.34 A03.F1 13.97,181.61 13.97,183.51 11.43,186.06 11.43,189.87 A03.C2 | A04.A1 17.14,132.72 17.14,127.64 A04.C1 17.78,126.36 23.5,126.36 D04.C2 24.13,126.36 29.84,126.36 D04.C1 | D04.C1 30.48,126.36 33.02,123.83 C22.D2 33.66,123.83 36.2,126.36 C22.C2 | 29.84,128.27 29.84,127.64 D04.C1 | 29.84,128.27 29.84,132.72 D04.A1 | 29.84,128.27 43.81,128.27 44.45,127.64 48.9,127.64 C32.C2 | A04.U2 11.43,83.19 13.97,85.72 A04.T1 13.97,86.36 13.97,91.44 A04.R1 13.97,92.71 13.97,97.79 | A04.R2 7.62,92.71 7.62,97.79 A04.N2 | A04.N2 7.62,99.06 7.62,104.14 A04.L2 7.62,105.41 7.62,110.49 A04.J2 7.62,111.76 7.62,116.84 A04.F2 8.26,116.84 13.97,116.84 A04.F1 13.97,118.11 13.97,120.02 11.43,122.56 11.43,126.36 A04.C2 | 13.97,97.79 8.26,97.79 A04.N2 | 13.97,97.79 A04.N1 | 26.04,17.14 19.68,17.14 19.05,16.51 14.61,16.51 C21.T1 | 26.04,17.14 26.67,16.51 C20.T1
  Top 0.254: 34.29,17.14 34.92,16.51 39.37,16.51 C1.T1 | 26.04,17.14 34.29,17.14 | 34.29,17.14 46.99,17.14 47.62,16.51 52.07,16.51 C3.T1 | 22.86,58.42 16.51,58.42 15.88,57.78 11.43,57.78 C21.C2 | 22.86,58.42 23.5,57.78 C20.C2 | 31.11,58.42 31.75,57.78 36.2,57.78 C1.C2 | 31.11,58.42 22.86,58.42 | 31.11,58.42 43.81,58.42 44.45,57.78 48.9,57.78 C3.C2 | D04.U2 24.13,83.19 26.67,85.72 D04.T1 27.3,86.36 29.84,86.36 32.38,88.9 | 26.67,94.61 26.67,97.79 D04.N1 | 26.67,94.61 26.67,92.71 D04.R1 | 26.67,94.61 32.38,88.9 | 32.38,88.9 34.92,86.36 39.37,86.36 C22.T1 | D04.R2 20.32,92.71 20.32,97.79 D04.N2 20.32,99.06 20.32,104.14 D04.L2 20.32,105.41 17.78,107.95 | 17.78,107.95 20.32,110.49 D04.J2 20.32,111.76 20.32,116.84 D04.F2 20.95,116.84 26.67,116.84 D04.F1 | 17.78,107.95 A04.K1
  Bottom 0.254: A02.F1 13.97,250.19 8.26,250.19 A02.F2 | A02.N1 13.97,231.14 8.26,231.14 A02.N2 | D02.R2 20.32,224.79 14.61,224.79 A02.R1 | A03.C2 11.43,189.87 17.14,189.87 A03.C1 | A03.N1 13.97,161.29 8.26,161.29 A03.N2 | A04.C2 11.43,126.36 17.14,126.36 A04.C1 | D04.K1 29.84,107.31 25.4,107.31 23.5,105.41 20.95,105.41 D04.L2 | D04.R1 26.67,91.44 20.95,91.44 D04.R2 | C1.C2 36.2,57.78 36.2,59.69 24.13,71.75 24.13,81.92 D04.U2 | C21.T1 13.97,16.51 11.43,16.51 6.35,21.59 6.35,54.61 8.26,56.52 10.79,56.52 C21.C2 | A04.N1 14.61,97.79 20.32,97.79 D04.N2 | D03.U2 23.5,145.41 23.5,139.7 17.78,133.99 A04.A1
IRQL
  Top 0.254: 47.62,99.69 47.62,102.87 46.35,104.14 C32.L2 | 47.62,99.69 47.62,97.79 39.37,89.53 36.83,89.53 C22.S2 | 80.01,93.98 73.66,93.98 73.03,94.61 68.58,94.61 C2.P1 67.94,94.61 66.67,93.34 61.59,93.34 55.24,99.69 47.62,99.69 | 80.01,93.98 80.64,94.61 C4.P1 | 88.27,93.98 88.9,94.61 93.34,94.61 C27.P1 | 80.01,93.98 88.27,93.98 | 88.27,93.98 100.97,93.98 101.6,94.61 106.05,94.61 C28.P1
MD09L  (via drill 0.61)
  Top 0.254: v41.27,34.29 44.45,34.29 45.09,33.66 64.14,33.66 | 64.14,33.66 64.77,34.29 D01.L1 | 72.39,33.66 73.03,34.29 77.47,34.29 D05.L1 | 64.14,33.66 72.39,33.66 | 85.09,33.66 85.72,34.29 90.17,34.29 D27.L1 | 72.39,33.66 85.09,33.66 | 85.09,33.66 97.79,33.66 98.42,34.29 102.87,34.29 D28.L1
  Bottom 0.254: v41.27,34.29 20.95,13.97 20.95,10.16 C20.V2
MD10L
  Top 0.254: 67.31,33.02 33.02,33.02 31.75,34.29 27.3,34.29 C20.L1 | 67.31,33.02 67.94,32.38 D01.M1 | 75.56,33.02 76.2,32.38 80.64,32.38 D05.M1 | 67.31,33.02 75.56,33.02 | 88.27,33.02 88.9,32.38 93.34,32.38 D27.M1 | 75.56,33.02 88.27,33.02 | 88.27,33.02 100.97,33.02 101.6,32.38 106.05,32.38 D28.M1
MD11L
  Top 0.254: 67.31,24.13 39.37,24.13 34.92,19.68 30.48,19.68 C20.S1 | 67.31,24.13 67.94,24.77 D01.P1 | 75.56,24.13 76.2,24.77 80.64,24.77 D05.P1 | 67.31,24.13 75.56,24.13 | 88.27,24.13 88.9,24.77 93.34,24.77 D27.P1 | 75.56,24.13 88.27,24.13 | 88.27,24.13 100.97,24.13 101.6,24.77 106.05,24.77 D28.P1
N$1
  Top 0.254: D20.B1 40.01,264.16 44.45,264.16 45.72,265.43 54.61,265.43 55.24,266.06 D21.A1
N$2
  Top 0.254: D20.E1 43.18,254.63 45.72,254.63 52.07,260.99 52.07,262.89 D21.B1
N$3
  Bottom 0.254: D20.H1 43.18,248.28 47.62,248.28 49.53,250.19 52.07,250.19 D21.F1
N$4  (via drill 0.61)
  Top 0.254: v50.8,245.11 47.62,241.94 43.18,241.94 D20.K1
  Bottom 0.254: v50.8,245.11 52.7,247.01 55.24,247.01 D21.H1
N$5
  Top 0.254: D20.P1 43.18,229.24 47.62,229.24 49.53,231.14 52.07,231.14 D21.N1
N$6
  Bottom 0.254: D20.M1 43.18,235.59 47.62,235.59 48.26,236.22 54.61,236.22 55.24,235.59 D21.M1
N$7  (via drill 0.61)
  Top 0.254: C20.M2 23.5,32.38 23.5,37.47 C20.K2 | v19.05,48.26 19.05,51.44 17.78,52.7 17.78,56.52 C21.C1
  Bottom 0.254: v19.05,48.26 19.05,40.64 20.95,38.73 23.5,38.73 C20.K2
N$8
  Top 0.254: D20.N2 33.66,231.14 33.66,229.24 41.91,220.98 48.26,220.98 48.9,221.62 D21.S2
N$9  (via drill 0.61)
  Top 0.254: v28.57,60.96 27.94,61.59 17.14,61.59 v16.51,60.96 | v5.71,71.75 5.71,90.17 5.08,90.81 5.08,131.44 v13.97,140.34 | v19.68,146.05 15.24,150.5 v15.24,152.4 | v32.38,229.87 33.02,229.24 33.02,227.97 36.2,224.79 36.2,222.88 D20.S2
  Bottom 0.254: v28.57,60.96 28.57,56.52 33.02,52.07 33.02,48.26 C1.F2 | v5.71,71.75 v16.51,60.96 | v19.68,146.05 v13.97,140.34 | v15.24,152.4 4.45,163.19 4.45,182.88 2.54,184.78 2.54,222.25 10.79,230.5 31.75,230.5 v32.38,229.87
N$10
  Top 0.254: D20.J2 33.66,243.84 36.83,243.84 41.27,239.4 45.09,239.4 45.72,238.76 D21.L2
N$11  (via drill 0.61)
  Top 0.254: v47.62,233.04 v42.55,238.12
  Bottom 0.254: v47.62,233.04 47.62,224.79 43.18,220.34 43.18,216.53 D20.U1 | v42.55,238.12 42.55,239.4 41.27,240.66 41.27,248.28 46.35,253.37 48.9,253.37 D21.E2
N$12  (via drill 0.61)
  Top 0.254: v53.98,231.14 45.72,222.88 43.18,222.88 D20.S1 | v53.98,234.95 v53.98,254
  Bottom 0.254: v53.98,231.14 v53.98,234.95 | v53.98,254 53.98,257.81 53.34,258.44 46.99,258.44 46.35,257.81 D21.D2
N$13
  Top 0.254: D20.F2 33.66,250.19 36.2,250.19 41.27,245.11 41.27,240.66 41.91,240.03 48.26,240.03 48.9,240.66 D21.K2
N$14  (via drill 0.61)
  Top 0.254: v42.55,231.14 36.2,237.49 33.66,237.49 D20.L2
  Bottom 0.254: v42.55,231.14 45.72,227.97 45.72,226.06 D21.R2
N$15  (via drill 0.61)
  Top 0.254: v5.08,29.21 8.26,26.04 10.79,26.04 C21.P2 | v57.15,268.61 17.14,268.61 9.53,260.99 9.53,253.37 v19.05,243.84 | v31.11,231.78 31.11,229.87 32.38,228.6 32.38,226.69 33.02,226.06 D20.R2
  Bottom 0.254: v5.08,29.21 5.08,16.51 14.61,6.99 71.12,6.99 107.95,43.81 107.95,115.57 98.42,125.09 98.42,127.64 108.58,137.79 108.58,217.17 v57.15,268.61 | v19.05,243.84 20.32,242.57 26.67,242.57 32.38,236.85 33.02,236.85 34.29,235.59 34.29,234.95 v31.11,231.78
N$16  (via drill 0.61)
  Top 0.254: 34.92,43.18 36.2,44.45 C1.H2 | 34.92,43.18 33.66,41.91 C1.J2 | v47.62,112.39 48.9,111.12 50.16,111.12 52.07,109.22 56.52,109.22 63.5,102.23 v63.5,94.61 | v44.45,43.81 43.81,43.18 34.92,43.18
  Bottom 0.254: v47.62,112.39 44.45,115.57 44.45,118.11 45.72,119.38 45.72,123.19 C32.D2 | v63.5,94.61 63.5,86.36 54.61,77.47 54.61,64.77 44.45,54.61 v44.45,43.81
N$17  (via drill 0.61)
  Top 0.254: v82.55,88.9 v82.55,73.03 | v50.8,269.88 17.14,269.88 6.35,259.08 6.35,254.63 15.88,245.11 15.88,221.62 22.86,214.63 26.67,214.63 30.48,218.44 33.02,218.44 D20.T2
  Bottom 0.254: v82.55,73.03 82.55,23.5 66.67,7.62 19.05,7.62 14.61,12.06 11.43,12.06 C21.U2 | v82.55,88.9 82.55,116.84 76.2,123.19 76.2,131.44 82.55,137.79 82.55,237.49 50.8,269.24 v50.8,269.88
N$19
  Top 0.254: C21.F1 13.97,48.26 11.43,50.8 C21.E2
N$20
  Bottom 0.254: C21.K1 17.14,38.73 14.61,38.73 9.53,43.81 9.53,52.07 8.26,53.34 C21.D2
N$23  (via drill 0.61)
  Top 0.254: v6.35,57.15 6.35,53.34 7.62,52.07 7.62,48.26 C21.F2 | v6.35,60.96 11.43,66.04 17.78,66.04 33.66,81.92 36.2,81.92 C22.U2
  Bottom 0.254: v6.35,57.15 v6.35,60.96
N$27
  Top 0.254: C20.E1 30.48,50.16 34.92,50.16 39.37,45.72 48.26,45.72 48.9,45.09 C3.H2
N$31
  Bottom 0.254: C3.T2 46.35,15.24 50.8,15.24 57.78,8.26 66.04,8.26 66.67,8.89 66.67,17.14 53.98,29.84 53.98,48.9 55.24,50.16 C3.E1
N$32  (via drill 0.61)
  Top 0.254: v29.21,28.57 v32.38,31.75 | v34.92,44.45 33.02,46.35 32.38,46.35 28.57,50.16 28.57,55.24 29.84,56.52 C20.C1
  Bottom 0.254: v29.21,28.57 20.32,19.68 17.78,19.68 C21.S1 | v32.38,31.75 34.92,34.29 v34.92,44.45
N$33  (via drill 0.61)
  Top 0.254: v31.75,33.02 29.21,33.02 21.59,25.4 20.95,25.4 18.41,27.94 14.61,27.94 C21.N1
  Bottom 0.254: v31.75,33.02 31.75,43.81 34.92,46.99 34.92,56.52 30.48,60.96 30.48,62.87 C20.A1
N$34  (via drill 0.61)
  Top 0.254: v5.08,31.75 7.62,29.21 C21.N2 | v9.53,59.05 26.04,59.05 26.67,59.69 C20.B1
  Bottom 0.254: v5.08,31.75 5.08,54.61 v9.53,59.05
N$35
  Top 0.254: C1.D2 33.66,53.34 36.2,50.8 C1.E2
N$36  (via drill 0.61)
  Top 0.254: v13.97,43.18 11.43,40.64 11.43,38.73 C21.K2
  Bottom 0.254: v13.97,43.18 15.24,43.18 27.94,30.48 35.56,30.48 36.2,31.11 C1.M2
N$37
  Bottom 0.254: C1.V2 33.02,10.16 33.02,13.97 31.75,15.24 31.75,20.32 33.02,21.59 C1.R2
N$38
  Top 0.254: C3.J2 46.35,41.91 50.8,41.91 52.7,43.81 55.24,43.81 C3.H1
N$40  (via drill 0.61)
  Top 0.254: 35.56,26.67 33.66,28.57 C1.N2 | 35.56,26.67 36.2,26.04 C1.P2 | v45.72,115.57 44.45,116.84 44.45,118.11 46.35,120.02 48.9,120.02 C32.E2 | v48.9,112.39 55.24,112.39 70.48,97.16 v74.93,97.16 | v55.88,29.84 38.73,29.84 35.56,26.67
  Bottom 0.254: C21.J2 8.26,40.64 11.43,40.64 22.23,29.84 32.38,29.84 33.02,29.21 C1.N2 | v48.9,112.39 v45.72,115.57 | v74.93,97.16 76.2,95.89 76.2,92.71 59.69,76.2 59.69,61.59 60.33,60.96 60.33,34.29 v55.88,29.84
N$43  (via drill 0.61)
  Top 0.254: 11.43,31.11 11.43,29.21 13.97,26.67 13.97,22.86 C21.R1 | 11.43,31.11 17.14,31.11 C21.M1 | 11.43,31.11 C21.M2 | v28.57,38.1 26.67,36.2 26.04,36.2 25.4,35.56 25.4,31.11 v20.95,26.67 | v52.7,107.95 52.07,107.95 49.53,110.49 46.35,110.49 C32.J2 | v28.57,66.04 v50.8,88.27
  Bottom 0.254: v28.57,38.1 28.57,48.26 27.3,49.53 27.3,53.34 C20.D1 26.67,54.61 25.4,55.88 25.4,60.96 28.57,64.14 v28.57,66.04 | v20.95,26.67 20.32,26.67 17.78,29.21 17.78,31.11 C21.M1 | v52.7,107.95 50.8,106.05 v50.8,88.27
OTP3
  Top 0.254: C1.K2 36.83,38.73 41.27,38.73 45.72,43.18 50.16,43.18 52.07,45.09 52.07,46.99 C3.F1 | 73.66,113.03 67.31,113.03 66.67,113.67 62.23,113.67 C2.H2 | 73.66,113.03 74.3,113.67 C4.H2 | 81.92,113.03 82.55,113.67 87,113.67 C27.H2 | 73.66,113.03 81.92,113.03 | 81.92,113.03 94.61,113.03 95.25,113.67 99.69,113.67 C28.H2
  Bottom 0.254: C3.F1 52.7,48.26 52.7,52.07 57.15,56.52 57.15,75.56 73.03,91.44 73.03,112.39 74.3,113.67 C4.H2
PAUSE
  Top 0.254: C21.T2 8.26,16.51 10.79,19.05 C21.S2
PAUSEL  (via drill 0.61)
  Top 0.254: 76.83,122.56 70.48,122.56 69.85,123.19 65.41,123.19 C2.D1 | 76.83,122.56 77.47,123.19 C4.D1 | 85.09,122.56 85.72,123.19 90.17,123.19 C27.D1 | 85.09,122.56 76.83,122.56 | 85.09,122.56 97.79,122.56 98.42,123.19 102.87,123.19 C28.D1 | C21.H1 17.14,44.45 14.61,41.91 C21.J1 13.97,40.64 v13.97,36.83 | C21.V2 7.62,10.16 7.62,13.97 6.35,15.24 6.35,20.32 7.62,21.59 C21.R2
  Bottom 0.254: v13.97,36.83 9.53,32.38 9.53,24.13 8.26,22.86 C21.R2 | C28.D1 103.5,123.19 106.05,123.19 108.58,120.65 108.58,43.18 71.75,6.35 10.79,6.35 8.26,8.89 C21.V2
POWEROK  (via drill 0.61)
  Top 0.254: v81.28,137.79 81.28,139.7 | 83.19,141.6 83.82,142.24 B27.V2 | 81.28,139.7 83.19,141.6 | 83.19,141.6 91.44,141.6 92.08,142.24 96.52,142.24 B28.V2 | 81.28,139.7 78.74,139.7 76.2,142.24 71.75,142.24 B2.V2
  Bottom 0.254: B1.V2 59.05,143.51 59.05,145.41 67.31,153.67 69.22,153.67 69.85,153.03 69.85,144.78 71.12,143.51 B2.V2 | v81.28,137.79 49.53,106.05 49.53,102.23 C32.M2
SETPAUSE  (via drill 0.61)
  Top 0.254: v33.66,223.52 32.38,222.25 28.57,226.06 v28.57,233.04 | v26.67,234.95 26.67,236.22 25.4,237.49 25.4,245.75 v32.38,252.73 | v87.63,118.11 90.17,115.57 100.97,115.57 107.95,108.58 107.95,88.27 62.23,42.55 53.34,42.55 52.7,41.91 C3.J1
  Bottom 0.254: v33.66,223.52 36.2,226.06 36.2,227.97 D20.P2 | v28.57,233.04 v26.67,234.95 | v32.38,252.73 50.8,271.14 53.34,271.14 85.72,238.76 85.72,120.02 v87.63,118.11
SKIPL  (via drill 0.61)
  Top 0.254: v41.27,104.78 41.27,104.14 36.83,99.69 36.83,95.89 C22.P2 | v42.55,106.05 47.62,106.05 48.9,107.31 C32.K2 49.53,107.31 52.07,107.31 v62.23,97.16 | C2.S1 68.58,88.27 73.03,88.27 73.66,87.63 80.01,87.63 80.64,88.27 C4.S1 81.28,89.53 81.92,89.53 82.55,90.17 92.71,90.17 93.34,89.53 C27.S1 93.98,88.27 98.42,88.27 99.06,87.63 105.41,87.63 106.05,88.27 C28.S1
  Bottom 0.254: v41.27,104.78 v42.55,106.05 | v62.23,97.16 67.94,91.44 67.94,89.53 C2.S1
T2
  Bottom 0.254: A04.T2 8.26,86.36 12.7,86.36 13.34,87 19.68,87 20.32,86.36 D04.T2
TP4  (via drill 0.61)
  Top 0.254: C2.J2 59.05,110.49 63.5,110.49 64.14,109.86 70.48,109.86 71.12,110.49 C4.J2 71.75,110.49 76.2,110.49 76.83,109.86 85.09,109.86 | v66.67,21.59 59.69,14.61 38.73,14.61 38.1,15.24 33.66,15.24 C1.T2 | 85.09,109.86 91.44,109.86 92.08,110.49 96.52,110.49 C28.J2 | 85.09,109.86 84.45,110.49 C27.J2
  Bottom 0.254: v66.67,21.59 66.67,26.67 73.03,33.02 73.03,72.39 85.72,85.09 85.72,109.22 84.45,110.49 C27.J2
V2
  Top 0.254: A04.V2 8.26,78.74 12.7,78.74 13.34,78.11 19.68,78.11 20.32,78.74 D04.V2
VCC  (via drill 0.61)
  Top 0.254: 22.86,64.77 16.51,64.77 15.88,64.14 11.43,64.14 C21.A2 | 22.86,64.77 23.5,64.14 C20.A2 | 31.11,64.77 31.75,64.14 36.2,64.14 C1.A2 | 31.11,64.77 22.86,64.77 | 31.11,64.77 43.81,64.77 44.45,64.14 48.9,64.14 C3.A2 49.53,64.14 57.15,71.75 v57.15,96.52 | D20.A2 36.83,267.33 41.27,267.33 41.91,267.97 48.26,267.97 48.9,267.33 D21.A2 | C22.A2 36.83,132.72 41.27,132.72 41.91,132.08 48.26,132.08 48.9,132.72 C32.A2 | 48.9,180.34 v53.98,175.26 | 48.9,180.34 36.83,192.41 36.83,196.22 D22.A2 | v73.03,204.47 48.9,180.34 | v57.15,122.56 v62.23,117.47
  Bottom 0.254: v53.98,175.26 53.98,138.43 49.53,133.99 C32.A2 49.53,132.72 49.53,130.18 v57.15,122.56 | v73.03,204.47 73.03,240.03 49.53,263.52 49.53,266.06 D21.A2 | v57.15,96.52 57.15,112.39 v62.23,117.47